# EAGLE design atmega_fusebit_doctor_V2e (EAGLE 5.07)
AUTHOR: PAWEL KISIELEWSKI (MANEKINEN); REV: 2.0
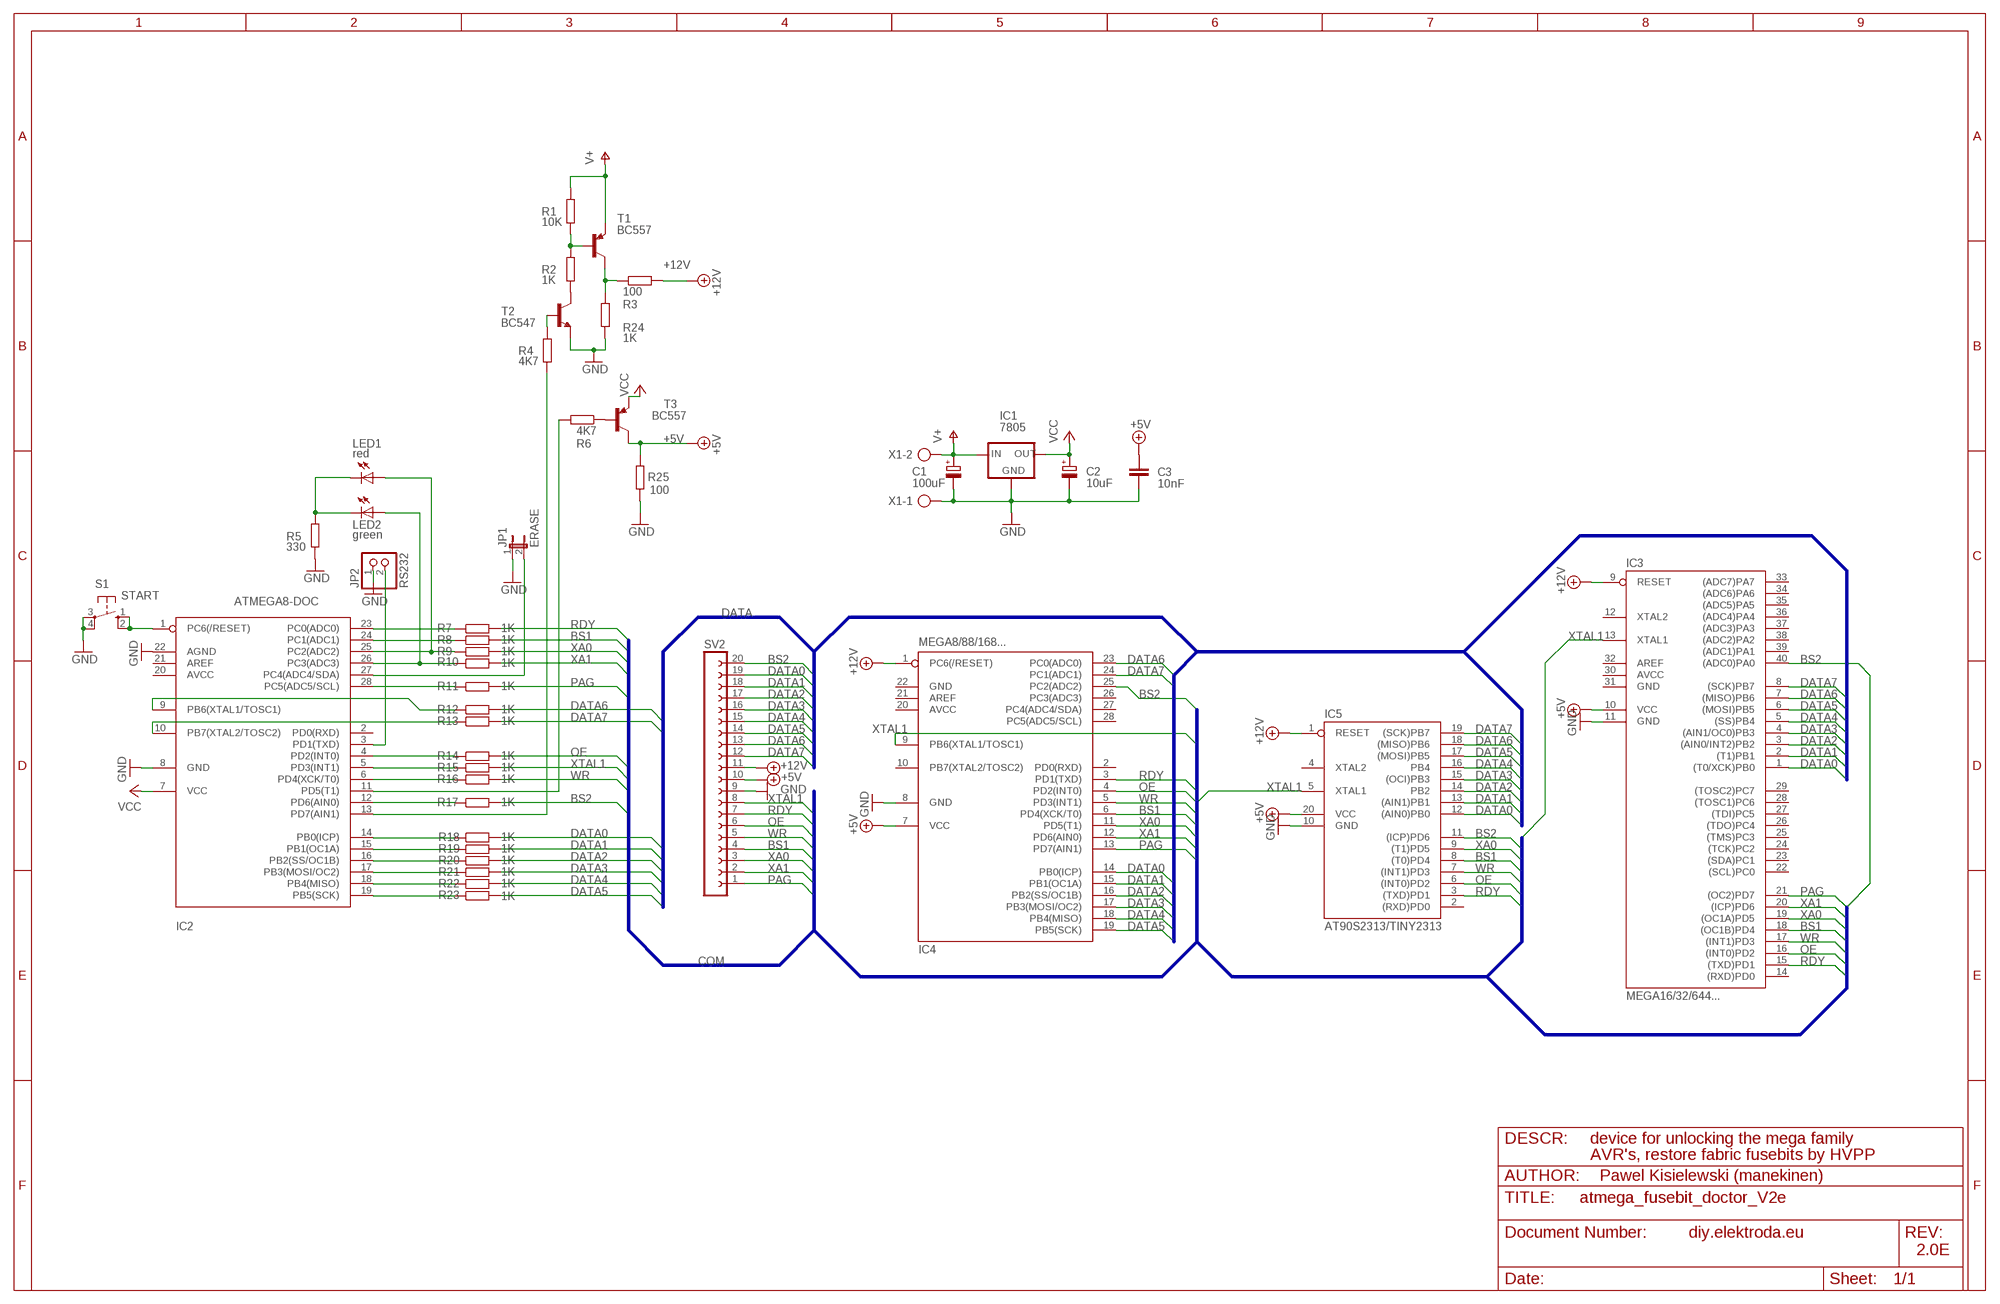
[diagram p0: schematic, sheet 1]

## Parts
C1  100uF  CPOL-EUE2.5-5  [E2,5-5]
C2  10uF  CPOL-EUE2.5-5  [E2,5-5]
C3  10nF  C-EU050-024X044  [C050-024X044]
IC1  7805  78XXL  [78XXL]
IC2  ATMEGA8-DOC  MEGA8-P  [DIL28-3]
IC3  MEGA16/32/644...  MEGA16-PZF1280  [240-1280-00-0602J]
IC4  MEGA8/88/168...  MEGA8-PZF-1277/3345  [228-1277-00-0602J]
IC5  AT90S2313/TINY2313  AT90S2313P  [DIL20]
JP1  ERASE  JP1E  [JP1]
JP2  RS232  PINHD-1X2  [1X02]
LED1  red  LED3MM  [LED3MM]
LED2  green  LED3MM  [LED3MM]
R1  10K  R-EU_0204/5  [0204/5]
R2  1K  R-EU_0204/5  [0204/5]
R3  100  R-EU_0204/5  [0204/5]
R4  4K7  R-EU_0204/5  [0204/5]
R5  330  R-EU_0204/5  [0204/5]
R6  4K7  R-EU_0204/5  [0204/5]
R7  1K  R-EU_0204/5  [0204/5]
R8  1K  R-EU_0204/5  [0204/5]
R9  1K  R-EU_0204/5  [0204/5]
R10  1K  R-EU_0204/5  [0204/5]
R11  1K  R-EU_0204/5  [0204/5]
R12  1K  R-EU_0204/5  [0204/5]
R13  1K  R-EU_0204/5  [0204/5]
R14  1K  R-EU_0204/5  [0204/5]
R15  1K  R-EU_0204/5  [0204/5]
R16  1K  R-EU_0204/5  [0204/5]
R17  1K  R-EU_0204/5  [0204/5]
R18  1K  R-EU_0204/5  [0204/5]
R19  1K  R-EU_0204/5  [0204/5]
R20  1K  R-EU_0204/5  [0204/5]
R21  1K  R-EU_0204/5  [0204/5]
R22  1K  R-EU_0204/5  [0204/5]
R23  1K  R-EU_0204/5  [0204/5]
R24  1K  R-EU_0204/5  [0204/5]
R25  100  R-EU_0204/5  [0204/5]
S1  START  10-XX  [B3F-10XX]
SV2  FE20-1  [FE20]
T1  BC557  BC557C-PNP-TO92-EBC  [TO92-EBC]
T2  BC547  BC547A-NPN-TO92-EBC  [TO92-EBC]
T3  BC557  BC557C-PNP-TO92-EBC  [TO92-EBC]
X1  AK500/2  [AK500/2]

## Nets
+5V: C3.1 IC3.10(VCC) IC4.7(VCC) IC5.20(VCC) R25.2 SV2.10 T3.C
+12V: IC3.9(RESET) IC4.1(PC6(/RESET)) IC5.1(RESET) R3.2 SV2.11
BS1: IC3.18((OC1B)PD4) IC4.6(PD4(XCK/T0)) IC5.8((T0)PD4) R8.2 SV2.4
BS2: IC3.40((ADC0)PA0) IC4.25(PC2(ADC2)) IC5.11((ICP)PD6) R17.2 SV2.20
DATA0: IC3.1((T0/XCK)PB0) IC4.14(PB0(ICP)) IC5.12((AIN0)PB0) R18.2 SV2.19
DATA1: IC3.2((T1)PB1) IC4.15(PB1(OC1A)) IC5.13((AIN1)PB1) R19.2 SV2.18
DATA2: IC3.3((AIN0/INT2)PB2) IC4.16(PB2(SS/OC1B)) IC5.14(PB2) R20.2 SV2.17
DATA3: IC3.4((AIN1/OC0)PB3) IC4.17(PB3(MOSI/OC2)) IC5.15((OCI)PB3) R21.2 SV2.16
DATA4: IC3.5((SS)PB4) IC4.18(PB4(MISO)) IC5.16(PB4) R22.2 SV2.15
DATA5: IC3.6((MOSI)PB5) IC4.19(PB5(SCK)) IC5.17((MOSI)PB5) R23.2 SV2.14
DATA6: IC3.7((MISO)PB6) IC4.23(PC0(ADC0)) IC5.18((MISO)PB6) R12.2 SV2.13
DATA7: IC3.8((SCK)PB7) IC4.24(PC1(ADC1)) IC5.19((SCK)PB7) R13.2 SV2.12
GND: C1.- C2.- C3.2 IC1.GND IC2.8(GND) IC2.22(AGND) IC3.11(GND) IC4.8(GND) IC5.10(GND) JP1.1 JP2.1 R5.1 R24.1 R25.1 S1.3(P) S1.4(P1) SV2.9 T2.E X1.1
N$1: R6.1 T3.B
N$2: IC2.14(PB0(ICP)) R18.1
N$3: IC2.3(PD1(TXD)) JP2.2
N$4: IC2.28(PC5(ADC5/SCL)) R11.1
N$5: IC2.6(PD4(XCK/T0)) R16.1
N$6: IC2.4(PD2(INT0)) R14.1
N$8: R2.2 T2.C
N$9: IC2.9(PB6(XTAL1/TOSC1)) R12.1
N$10: IC2.10(PB7(XTAL2/TOSC2)) R13.1
N$11: IC2.13(PD7(AIN1)) R4.2
N$12: IC2.11(PD5(T1)) R6.2
N$14: IC2.15(PB1(OC1A)) R19.1
N$16: IC2.16(PB2(SS/OC1B)) R20.1
N$19: IC2.5(PD3(INT1)) R15.1
N$21: IC2.23(PC0(ADC0)) R7.1
N$22: R3.1 R24.2 T1.C
N$24: IC2.17(PB3(MOSI/OC2)) R21.1
N$25: IC2.18(PB4(MISO)) R22.1
N$26: IC2.19(PB5(SCK)) R23.1
N$27: IC2.12(PD6(AIN0)) R17.1
N$29: R4.1 T2.B
N$31: IC2.27(PC4(ADC4/SDA)) JP1.2
N$32: LED1.K(C) LED2.K(C) R5.2
N$34: R1.2 R2.1 T1.B
N$42: IC2.24(PC1(ADC1)) R8.1
N$43: IC2.1(PC6(/RESET)) S1.1(S) S1.2(S1)
N$47: IC2.26(PC3(ADC3)) LED2.A R10.1
N$48: IC2.25(PC2(ADC2)) LED1.A R9.1
OE: IC3.16((INT0)PD2) IC4.4(PD2(INT0)) IC5.6((INT0)PD2) R14.2 SV2.6
PAG: IC3.21((OC2)PD7) IC4.13(PD7(AIN1)) R11.2 SV2.1
RDY: IC3.15((TXD)PD1) IC4.3(PD1(TXD)) IC5.3((TXD)PD1) R7.2 SV2.7
V+: C1.+ IC1.IN R1.1 T1.E X1.2
VCC: C2.+ IC1.OUT IC2.7(VCC) T3.E
WR: IC3.17((INT1)PD3) IC4.5(PD3(INT1)) IC5.7((INT1)PD3) R16.2 SV2.5
XA0: IC3.19((OC1A)PD5) IC4.11(PD5(T1)) IC5.9((T1)PD5) R9.2 SV2.3
XA1: IC3.20((ICP)PD6) IC4.12(PD6(AIN0)) R10.2 SV2.2
XTAL1: IC3.13(XTAL1) IC4.9(PB6(XTAL1/TOSC1)) IC5.5(XTAL1) R15.2 SV2.8
Unconnected: IC2.2(PD0(RXD)) IC2.20(AVCC) IC2.21(AREF) IC3.12(XTAL2) IC3.14((RXD)PD0) IC3.22((SCL)PC0) IC3.23((SDA)PC1) IC3.24((TCK)PC2) IC3.25((TMS)PC3) IC3.26((TDO)PC4) IC3.27((TDI)PC5) IC3.28((TOSC1)PC6) IC3.29((TOSC2)PC7) IC3.32(AREF) IC3.33((ADC7)PA7) IC3.34((ADC6)PA6) IC3.35((ADC5)PA5) IC3.36((ADC4)PA4) IC3.37((ADC3)PA3) IC3.38((ADC2)PA2) IC3.39((ADC1)PA1) IC4.2(PD0(RXD)) IC4.10(PB7(XTAL2/TOSC2)) IC4.21(AREF) IC4.26(PC3(ADC3)) IC4.27(PC4(ADC4/SDA)) IC4.28(PC5(ADC5/SCL)) IC5.2((RXD)PD0) IC5.4(XTAL2)

## Buses
DATA
COM

## Notes on the sheet
- DESCR: | device for unlocking the mega family
- AVR's, restore fabric fusebits by HVPP
- AUTHOR: | Pawel Kisielewski (manekinen)
- diy.elektroda.eu
- 2.0E

## Power pins joined to a net without a drawn wire
AVCC: IC3.30(AVCC) IC4.20(AVCC)
GND: IC3.31(GND) IC4.22(GND)

## Library data of the parts
C1 C2 = rcl:CPOL-EU: POLARIZED CAPACITOR, European symbol
C3 = rcl:C-EU: CAPACITOR, European symbol
IC1 = v-reg:78XXL: VOLTAGE REGULATOR
IC2 = atmel:MEGA8-P: MICROCONTROLLER 8 Kbytes FLASH 1 kbytes SRAM 512 bytes EEPROM USART 4-channel 10 bit ADC 2-channel 8 bit ADC Source: avr.lbr
IC3 = digital-toy:MEGA16-P: MICROCONTROLLER 16 Kbytes FLASH 1 kbytes SRAM 512 bytes EEPROM USART 8-channel 10 bit ADC Source: avr.lbr
IC4 = digital-toy:MEGA8-P: MICROCONTROLLER 8 Kbytes FLASH, 1 kbytes SRAM, 512 bytes EEPROM, USART, 4-channel 10 bit ADC, 2-channel 8 bit ADC Pin compatible with Atmega48, ATMega88, ATMega168 Source: avr.lbr
IC5 = atmel:AT90S2313: MICROCONTROLLER 2 Kbytes FLASH 128 bytes SRAM 128 bytes EEPROM UART
JP1 = jumper:JP1E: JUMPER
JP2 = pinhead:PINHD-1X2: PIN HEADER
LED1 LED2 = led:LED: LED OSRAM: - CHIPLED LG R971, LG N971, LY N971, LG Q971, LY Q971, LO R971, LY R971 LH N974, LH R974 LS Q976, LO Q976, LY Q976 LO Q996 - Hyper CHIPLED LW Q18S LB Q993, LB Q99A, LB R99A - SideLED LS A670, LO A670, LY A670, LG A670, LP A670 LB A673, LV A673, LT A673, LW A673 LH A674 LY A675 LS A676, LA A676, LO A676, LY A676, LW A676 LS A679, LY A679, LG A679 - Hyper Micro SIDELED® LS Y876, LA Y876, LO Y876, LY Y876 LT Y87S - SmartLED LW L88C, LW L88S LB L89C, LB L89S, LG L890 LS L89K, LO L89K, LY L89K LS L896, LA L896, LO L896, LY L896 - TOPLED LS T670, LO T670, LY T670, LG T670, LP T670 LSG T670, LSP T670, LSY T670, LOP T670, LYG T670 LG T671, LOG T671, LSG T671 LB T673, LV T673, LT T673, LW T673 LH T674 LS T676, LA T676, LO T676, LY T676, LB T676, LH T676, LSB T676, LW T676 LB T67C, LV T67C, LT T67C, LS T67K, LO T67K, LY T67K, LW E67C LS E67B, LA E67B, LO E67B, LY E67B, LB E67C, LV E67C, LT E67C LW T67C LS T679, LY T679, LG T679 LS T770, LO T770, LY T770, LG T770, LP T770 LB T773, LV T773, LT T773, LW T773 LH T774 LS E675, LA E675, LY E675, LS T675 LS T776, LA T776, LO T776, LY T776, LB T776 LHGB T686 LT T68C, LB T68C - Hyper Mini TOPLED® LB M676 - Mini TOPLED Santana® LG M470 LS M47K, LO M47K, LY M47K Source: http://www.osram.convergy.de - LUMILED® LXK2-PW12-R00, LXK2-PW12-S00, LXK2-PW14-U00, LXK2-PW14-V00 LXK2-PM12-R00, LXK2-PM12-S00, LXK2-PM14-U00 LXK2-PE12-Q00, LXK2-PE12-R00, LXK2-PE12-S00, LXK2-PE14-T00, LXK2-PE14-U00 LXK2-PB12-K00, LXK2-PB12-L00, LXK2-PB12-M00, LXK2-PB14-N00, LXK2-PB14-P00, LXK2-PB14-Q00 LXK2-PR12-L00, LXK2-PR12-M00, LXK2-PR14-Q00, LXK2-PR14-R00 LXK2-PD12-Q00, LXK2-PD12-R00, LXK2-PD12-S00 LXK2-PH12-R00, LXK2-PH12-S00 LXK2-PL12-P00, LXK2-PL12-Q00, LXK2-PL12-R00 Source: www.luxeon.com
R1-R25 = rcl:R-EU_: RESISTOR, European symbol
S1 = switch-omron:10-XX: OMRON SWITCH
SV2 = con-lsta:FE20-1: FEMALE HEADER
T1 T3 = transistor:*-PNP-: PNP Transistror
T2 = transistor:*-NPN-: NPN Transistror
X1 = con-ptr500:AK500/2: CONNECTOR

## Board
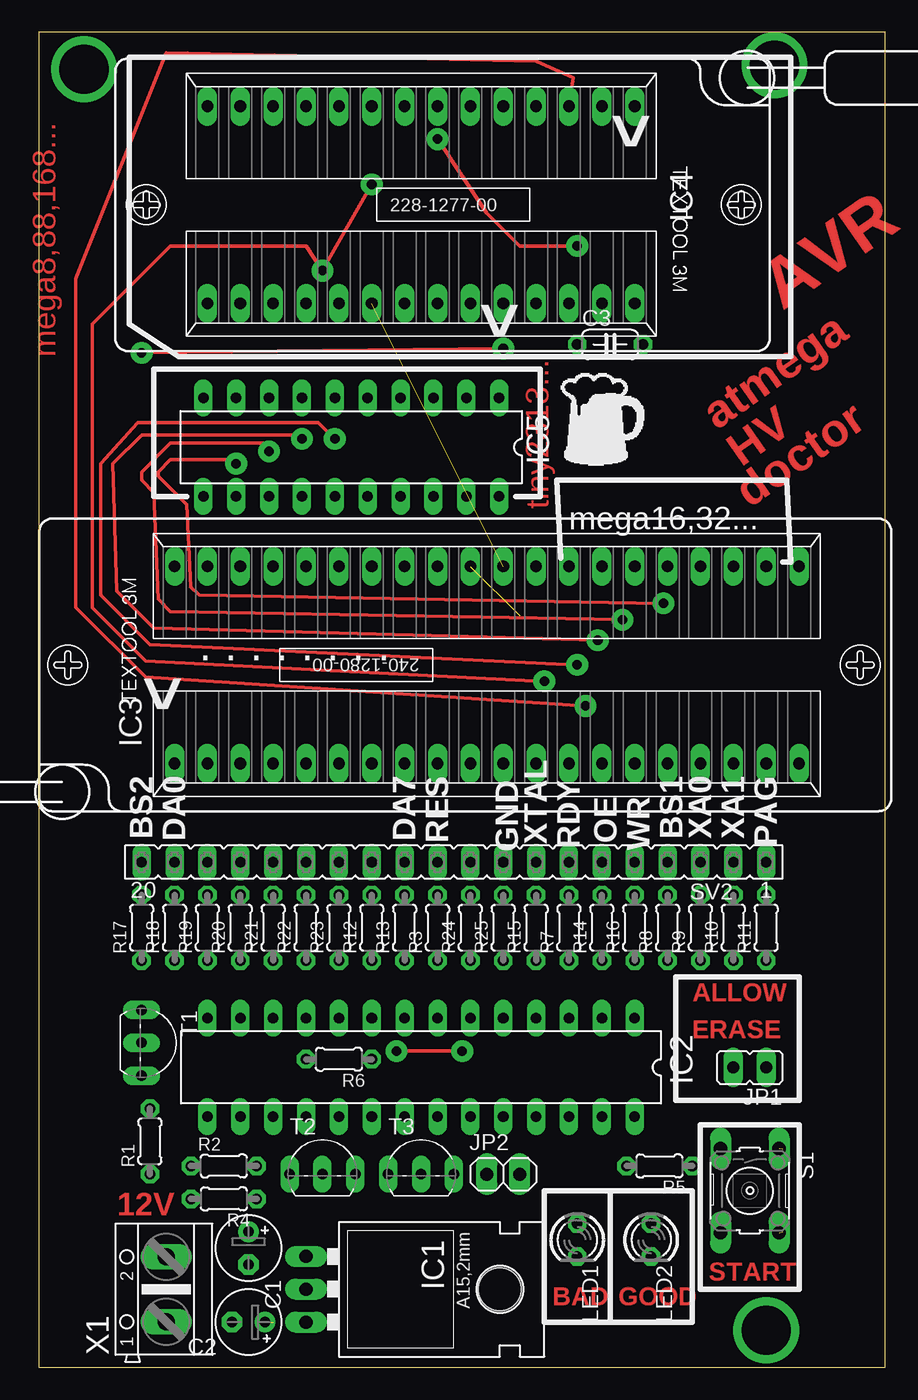
[diagram p1: board, top side]
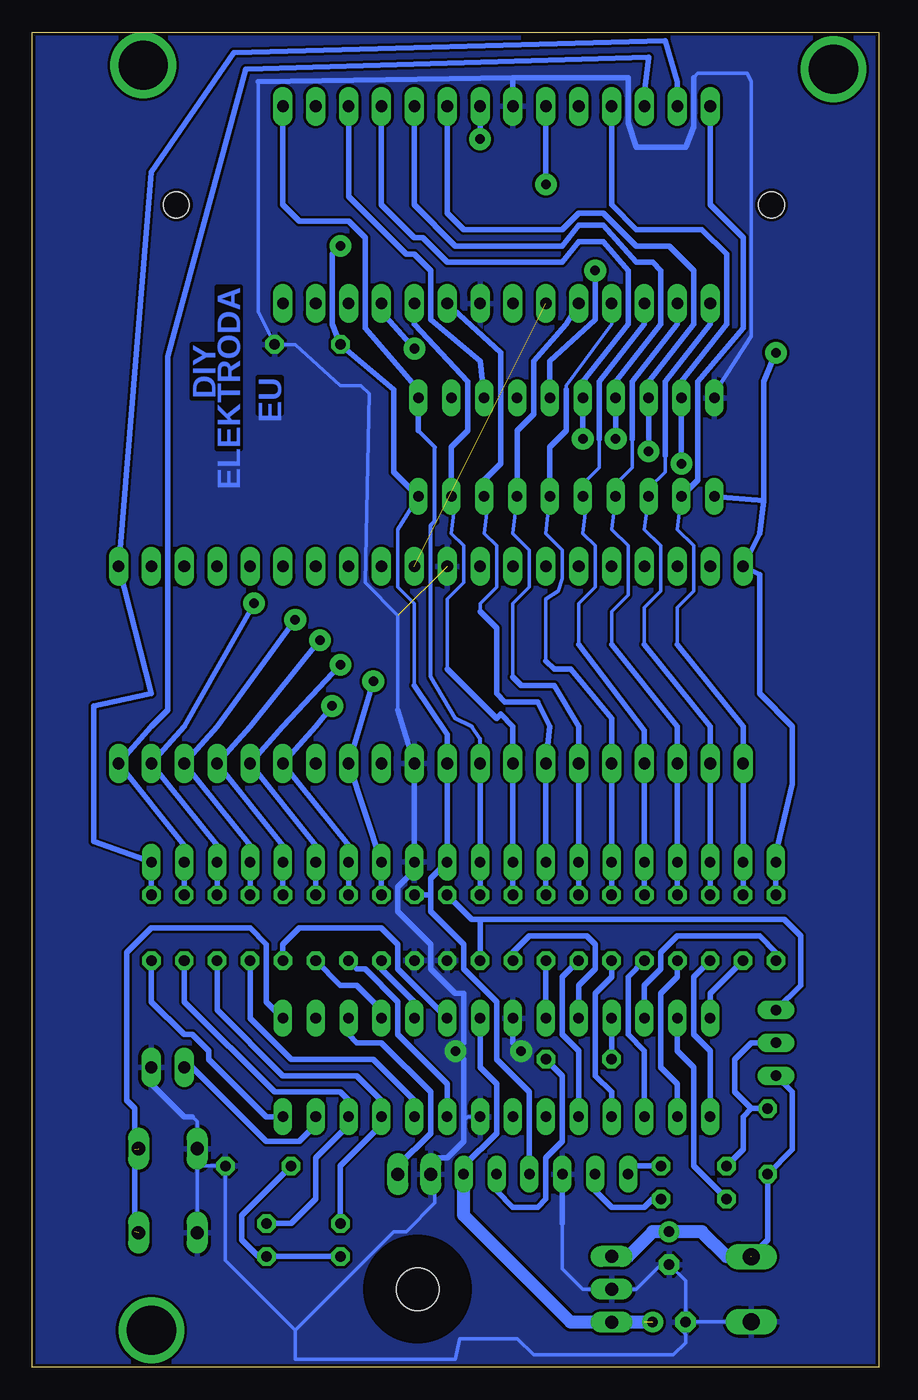
[diagram p2: board, bottom side, seen from below]

Size 65.39 x 103.18 mm. Coordinates in mm from the lower left corner, seen from the top.
Outline: 0,103.18 0,0 65.4,0 65.4,103.18 0,103.18
Copper layers (1*16): Top 0.035mm / dielectric 1.5mm / Bottom 0.035mm
Design rules "SparkFun": minimum track width 8mil, minimum drill 20mil, track to track 8mil, track to pad 8mil, pad to pad 8mil, via to via 8mil, smd to smd 8mil, copper to edge 10mil, drill to drill 8mil, minimum pad ring 12mil, minimum via ring 10mil, stop-mask expansion 4mil, vias tented up to drill 25mil, thermal gap 10mil

### Footprints (pad centres in the part's own frame; a part is rotated, then mirrored left to right if it is on the bottom)
E2,5-5 = drill 0.813 pad 1.6 round: + -1.27,0 | drill 0.813 pad 1.6 octagon: - 1.27,0
C050-024X044 = drill 0.813 octagon: 1 -2.54,0; 2 2.54,0
78XXL = drill 1.016 long: GND 0,-3.81; IN -2.54,-3.81; OUT 2.54,-3.81 | hole 3.302: 0,11.176
DIL28-3 = drill 0.813 long: 1 -16.51,-3.81; 2 -13.97,-3.81; 3 -11.43,-3.81; 4 -8.89,-3.81; 5 -6.35,-3.81; 6 -3.81,-3.81; 7 -1.27,-3.81; 8 1.27,-3.81; 9 3.81,-3.81; 10 6.35,-3.81; 11 8.89,-3.81; 12 11.43,-3.81; 13 13.97,-3.81; 14 16.51,-3.81; 15 16.51,3.81; 16 13.97,3.81; 17 11.43,3.81; 18 8.89,3.81; 19 6.35,3.81; 20 3.81,3.81; 21 1.27,3.81; 22 -1.27,3.81; 23 -3.81,3.81; 24 -6.35,3.81; 25 -8.89,3.81; 26 -11.43,3.81; 27 -13.97,3.81; 28 -16.51,3.81
240-1280-00-0602J = drill 0.9 long: 1 -24.13,-7.62; 2 -21.59,-7.62; 3 -19.05,-7.62; 4 -16.51,-7.62; 5 -13.97,-7.62; 6 -11.43,-7.62; 7 -8.89,-7.62; 8 -6.35,-7.62; 9 -3.81,-7.62; 10 -1.27,-7.62; 11 1.27,-7.62; 12 3.81,-7.62; 13 6.35,-7.62; 14 8.89,-7.62; 15 11.43,-7.62; 16 13.97,-7.62; 17 16.51,-7.62; 18 19.05,-7.62; 19 21.59,-7.62; 20 24.13,-7.62; 21 24.13,7.62; 22 21.59,7.62; 23 19.05,7.62; 24 16.51,7.62; 25 13.97,7.62; 26 11.43,7.62; 27 8.89,7.62; 28 6.35,7.62; 29 3.81,7.62; 30 1.27,7.62; 31 -1.27,7.62; 32 -3.81,7.62; 33 -6.35,7.62; 34 -8.89,7.62; 35 -11.43,7.62; 36 -13.97,7.62; 37 -16.51,7.62; 38 -19.05,7.62; 39 -21.59,7.62; 40 -24.13,7.62
228-1277-00-0602J = drill 0.9 long: 1 -16.51,-7.62; 2 -13.97,-7.62; 3 -11.43,-7.62; 4 -8.89,-7.62; 5 -6.35,-7.62; 6 -3.81,-7.62; 7 -1.27,-7.62; 8 1.27,-7.62; 9 3.81,-7.62; 10 6.35,-7.62; 11 8.89,-7.62; 12 11.43,-7.62; 13 13.97,-7.62; 14 16.51,-7.62; 15 16.51,7.62; 16 13.97,7.62; 17 11.43,7.62; 18 8.89,7.62; 19 6.35,7.62; 20 3.81,7.62; 21 1.27,7.62; 22 -1.27,7.62; 23 -3.81,7.62; 24 -6.35,7.62; 25 -8.89,7.62; 26 -11.43,7.62; 27 -13.97,7.62; 28 -16.51,7.62 | hole 2: 21.24,0; -24.74,0
DIL20 = drill 0.813 long: 1 -11.43,-3.81; 2 -8.89,-3.81; 3 -6.35,-3.81; 4 -3.81,-3.81; 5 -1.27,-3.81; 6 1.27,-3.81; 7 3.81,-3.81; 8 6.35,-3.81; 9 8.89,-3.81; 10 11.43,-3.81; 11 11.43,3.81; 12 8.89,3.81; 13 6.35,3.81; 14 3.81,3.81; 15 1.27,3.81; 16 -1.27,3.81; 17 -3.81,3.81; 18 -6.35,3.81; 19 -8.89,3.81; 20 -11.43,3.81
JP1 = drill 0.914 long: 1 0,-1.27; 2 0,1.27
1X02 = drill 1.016 long: 1 -1.27,0; 2 1.27,0
LED3MM = drill 0.813 octagon: A -1.27,0; K 1.27,0
0204/5 = drill 0.813 octagon: 1 -2.54,0; 2 2.54,0
B3F-10XX = drill 1.016 long: 1 -3.251,2.261; 2 3.251,2.261; 3 -3.251,-2.261; 4 3.251,-2.261
FE20 = drill 0.813 long: 1 -24.13,0; 2 -21.59,0; 3 -19.05,0; 4 -16.51,0; 5 -13.97,0; 6 -11.43,0; 7 -8.89,0; 8 -6.35,0; 9 -3.81,0; 10 -1.27,0; 11 1.27,0; 12 3.81,0; 13 6.35,0; 14 8.89,0; 15 11.43,0; 16 13.97,0; 17 16.51,0; 18 19.05,0; 19 21.59,0; 20 24.13,0
TO92-EBC = drill 0.813 long: B 0,-1.27; C -2.54,-1.27; E 2.54,-1.27
AK500/2 = drill 1.321 long: 1 -2.515,0; 2 2.515,0

### Placement (x,y rotation side)
C1  16.19,9.2 270 top
C2  16.19,3.48 180 top
C3  44.13,79.05 0 top
IC1  24.45,6.02 270 top
IC2  29.53,23.17 180 top
IC3  34.61,54.28 0 top
IC4  29.53,89.84 180 top
IC5  24.13,71.11 180 top
JP1  54.93,23.17 90 top
JP2  35.88,14.91 0 top
LED1  41.59,9.83 270 top
LED2  47.31,9.83 270 top
R1  8.57,17.45 90 top
R2  14.29,15.55 0 top
R3  30.8,33.96 90 top
R4  14.29,13.01 180 top
R5  47.94,15.55 180 top
R6  23.18,23.8 180 top
R7  40.96,33.96 90 top
R8  48.58,33.96 90 top
R9  51.12,33.96 90 top
R10  53.66,33.96 90 top
R11  56.2,33.96 90 top
R12  25.72,33.96 90 top
R13  28.26,33.96 90 top
R14  43.5,33.96 90 top
R15  38.42,33.96 90 top
R16  46.04,33.96 90 top
R17  7.94,33.96 90 top
R18  10.48,33.96 90 top
R19  13.02,33.96 90 top
R20  15.56,33.96 90 top
R21  18.1,33.96 90 top
R22  20.64,33.96 90 top
R23  23.18,33.96 90 top
R24  33.34,33.96 90 top
R25  35.88,33.96 90 top
S1  54.93,13.64 270 top
SV2  32.07,39.04 180 top
T1  9.21,25.07 270 top
T2  21.91,16.18 0 top
T3  29.53,16.18 0 top
X1  9.84,6.02 90 top

### Tracks (layer width: path | path; a pad name or v marks a point on that pad's centre or on a via)
+5V  (via drill 0.74 pad 1.68)
  Top 0.254: v41.59,86.67 37.15,86.67 34.61,89.21 v30.8,94.92
  Bottom 0.254: 35.88,52.69 35.88,59.04 37.15,60.32 37.15,64.76 IC5.20
  Bottom 0.406: 35.88,52.69 33.34,48.89 IC3.10 SV2.10 34.61,37.77 34.61,36.5 | v30.8,94.92 IC4.7 | IC5.20 37.47,69.2 37.47,75.56 C3.1 42.23,80.64 42.23,86.03 v41.59,86.67 | 34.61,36.5 34.61,35.23 32.07,32.69 32.07,30.79 29.53,28.25 29.53,23.8 26.99,21.26 T3.C | 34.61,36.5 R25.2
+12V
  Bottom 0.305: 35.56,72.38 34.29,71.11 34.29,65.4 34.61,65.08 34.61,53.33 32.7,50.15 31.43,49.52 30.8,48.57 IC3.9
  Bottom 0.406: IC4.1 46.04,89.84 44.77,88.57 40.96,88.57 39.69,87.3 39.69,80.32 35.56,75.56 IC5.1 35.56,72.38 | SV2.11 IC3.9 | SV2.11 30.8,38.41 | R3.2 SV2.11
AVCC  (1 unrouted)
BS1  (via drill 0.74 pad 1.68)
  Top 0.254: v45.09,57.77 10.16,58.41 9.21,59.36 8.89,67.62 7.94,68.57 7.94,69.2 10.16,71.43 17.46,71.43 v17.78,70.79
  Bottom 0.406: IC4.6 33.34,89.21 32.07,87.94 24.45,87.94 23.18,89.21 21.27,89.21 18.73,86.67 16.19,86.67 14.29,84.76 14.29,80.64 17.78,76.19 IC5.8 v17.78,70.79 | v45.09,57.77 51.12,49.52 IC3.18 48.58,40.31 SV2.4 R8.2
BS2  (via drill 0.74 pad 1.68)
  Top 0.254: v7.94,78.41 v35.88,78.73
  Bottom 0.406: v7.94,78.41 8.89,76.19 8.89,66.98 | IC4.25 38.42,81.59 v35.88,78.73 | 8.89,66.98 9.21,64.44 IC3.40 9.21,61.27 9.21,52.06 6.67,49.52 6.67,45.08 7.94,39.68 SV2.20 R17.2 | 8.89,66.98 IC5.11
DATA0
  Bottom 0.254: 15.56,55.87 15.56,58.73 14.29,60 14.29,63.49 15.56,64.76 IC5.12
  Bottom 0.406: IC4.14 13.02,89.84 10.48,87.3 10.48,80.32 13.97,76.19 13.97,68.57 IC5.12 | 15.56,55.87 10.48,49.52 IC3.1 SV2.19 R18.2
DATA1
  Bottom 0.254: 18.1,55.87 18.1,58.73 16.83,60 16.83,63.49 18.1,64.76 IC5.13 17.78,67.94 16.51,69.2 16.51,70.48
  Bottom 0.406: IC4.15 13.02,80.64 16.51,76.19 16.51,70.48 | 18.1,55.87 13.02,49.52 IC3.2 SV2.18 R19.2
DATA2
  Bottom 0.254: 20.64,55.87 20.64,58.41 19.37,59.68 19.37,63.49 20.64,64.76 IC5.14 20.32,68.25 19.05,69.52 19.05,71.75
  Bottom 0.406: IC4.16 15.56,80.64 19.05,76.19 19.05,71.75 | 20.64,55.87 15.56,49.52 IC3.3 SV2.17 R20.2
DATA3
  Bottom 0.254: 23.18,55.87 23.18,59.04 21.91,60.32 21.91,63.49 22.86,64.44 22.54,66.98 IC5.15 22.86,68.25 21.59,69.52 21.59,71.75
  Bottom 0.406: IC4.17 18.1,80.64 21.59,76.19 21.59,71.75 | 23.18,55.87 18.1,49.2 IC3.4 SV2.16 R21.2
DATA4
  Bottom 0.254: 25.72,54.6 25.72,59.36 24.76,60 24.45,60.95 24.45,63.17 25.72,64.44 IC5.16 | 24.13,75.56 24.13,75.87 20.64,80.64 IC4.18
  Bottom 0.406: 24.13,75.56 24.13,72.38 25.4,71.11 IC5.16 | 25.72,54.6 25.08,53.97 23.81,53.97 20.64,50.15 IC3.5 SV2.15 R22.2
DATA5
  Bottom 0.254: 28.26,53.33 28.26,59.04 26.99,60.32 26.99,63.17 28.26,64.44 IC5.17
  Bottom 0.406: IC4.19 24.13,80.64 26.67,77.78 26.67,73.65 27.94,72.38 IC5.17 | 28.26,53.33 27.62,52.69 25.08,52.69 23.18,49.52 IC3.6 SV2.14 R23.2
DATA6
  Bottom 0.254: 30.8,58.41 30.8,59.04 29.53,60.32 29.53,63.49 30.48,64.44 30.16,66.98 IC5.18
  Bottom 0.406: IC4.23 29.21,78.41 29.21,69.84 30.48,68.57 IC5.18 | 30.8,58.41 29.53,57.14 29.53,52.06 28.89,51.43 26.35,51.43 25.4,49.52 IC3.7 SV2.13 R12.2
DATA7
  Bottom 0.254: 33.34,53.97 33.34,59.36 32.07,60.63 32.07,63.49 33.02,64.44 32.7,66.98 IC5.19
  Bottom 0.406: IC4.24 35.88,80.64 31.75,76.19 31.75,72.38 33.02,71.11 IC5.19 | 33.34,53.97 29.53,50.15 29.21,50.47 28.26,49.52 IC3.8 SV2.12 R13.2
GND  (via drill 0.74 pad 1.68)  (1 unrouted)
  Top 0.254: v32.7,24.44 v27.62,24.44
  Bottom 0.254: 37.15,50.79 37.15,58.09 39.69,60.63 39.37,75.24 40.01,75.87 41.59,75.87 45.09,79.05 C3.2 47.94,81.59 47.94,99.37 | X1.1 14.92,3.51 C2.- | C2.- 14.92,6.66 C1.- 16.83,7.93 18.73,6.02 IC1.GND 22.86,6.02 24.45,7.61 24.45,11.1 | 52.67,15.55 S1.4 | 52.67,15.55 S1.3 52.67,19 53.02,19.36 | 52.67,15.55 R5.1 50.48,8.25 45.09,2.85 | JP2.1 34.29,14.6 34.29,12.69 36.51,10.47 37.47,10.47 45.09,2.85 | IC2.22 31.75,19.36 32.07,19.04 | C2.- 15.24,3.16 15.24,2.85 14.92,2.53 14.92,1.9 15.87,0.94 26.67,0.94 27.94,2.21 32.39,2.21 32.7,0.63 45.09,0.63 45.09,2.85 | IC5.10 12.7,75.24 9.84,79.68 9.84,99.37 10.16,100 13.97,100 14.29,99.69
  Bottom 0.406: 14.29,99.69 14.29,95.87 14.92,94.29 18.73,94.29 19.37,96.19 19.37,99.69 28.26,99.69 | 37.15,50.79 IC3.11 SV2.9 35.88,38.41 37.15,37.14 37.15,35.23 34.61,32.69 34.61,30.79 32.7,28.88 32.07,28.88 32.07,25.07 v32.7,24.44 32.07,23.8 32.07,19.04 32.07,17.45 33.34,16.18 34.61,16.18 JP2.1 | v27.62,24.44 28.26,25.07 IC2.8 | 28.26,99.69 IC4.8 | 47.94,99.37 28.26,99.69 | 24.45,11.1 T2.E | JP1.1 56.2,21.9 53.66,19.36 53.02,19.36
  pour Bottom: 75.25,107.31 -5.72,105.72 -5.72,-20.01 73.66,-21.28
N$1
  Bottom 0.406: R6.1 24.45,22.53 24.45,17.45 25.72,16.18 25.72,13.01 26.35,12.37 28.26,12.37 29.53,13.64 T3.B
N$2
  Bottom 0.406: R18.1 13.02,28.88 IC2.14
N$3
  Bottom 0.406: IC2.3 40.96,25.71 40.32,25.07 38.42,25.07 34.61,21.26 34.61,18.09 37.15,15.55 JP2.2
N$4
  Bottom 0.406: R11.1 56.2,28.25 53.66,25.71 53.02,25.71 51.75,24.44 51.75,23.8 47.31,19.36 IC2.28
N$5
  Bottom 0.406: R16.1 46.04,32.69 44.77,33.96 38.42,33.96 37.15,32.69 37.15,30.79 IC2.6
N$6
  Bottom 0.406: R14.1 41.59,29.52 40.32,29.52 38.42,27.61 IC2.4
N$8
  Bottom 0.406: R2.2 18.73,15.55 T2.C
N$9
  Bottom 0.406: IC2.9 R12.1
N$10
  Bottom 0.406: IC2.10 23.18,29.52 21.91,30.79 21.91,32.69 22.54,33.33 26.99,33.33 28.26,32.06 R13.1
N$11
  Bottom 0.406: R4.2 14.29,15.55 14.29,23.17 15.56,24.44 IC2.13
N$12
  Bottom 0.406: R6.2 IC2.11
N$13  (via drill 3.81 pad 5.08)
  other vias: 56.2,2.85
N$14
  Bottom 0.406: R19.1 14.29,30.15 14.29,25.71 13.02,24.44 IC2.15
N$15  (via drill 3.81 pad 5.08)
  other vias: 56.83,100.64
N$16
  Bottom 0.406: R20.1 15.56,30.15 16.83,28.88 16.83,23.17 15.56,21.9 IC2.16
N$17  (via drill 3.81 pad 5.08)
  other vias: 3.49,100.32
N$19
  Bottom 0.406: R15.1 38.42,30.79 35.88,28.25 IC2.5
N$21
  Bottom 0.406: R7.1 40.32,30.79 39.69,30.79 37.15,28.25 37.15,25.71 33.34,21.9 IC2.23
N$22
  Bottom 0.406: 30.8,34.6 R3.1 | 30.8,34.6 7.3,34.6 6.03,33.33 6.03,29.52 T1.C | 30.8,34.6 31.43,34.6 R24.2
N$24
  Bottom 0.406: R21.1 19.37,30.15 19.37,25.71 18.1,24.44 IC2.17
N$25
  Bottom 0.406: R22.1 20.64,30.15 21.91,28.88 21.91,22.53 20.64,21.26 IC2.18
N$26
  Bottom 0.406: R23.1 24.45,30.15 24.45,25.71 23.18,24.44 IC2.19
N$27
  Bottom 0.406: R17.1 7.94,32.06 9.21,33.33 15.56,33.33 16.83,32.06 16.83,30.79 18.1,29.52 IC2.12
N$29
  Bottom 0.406: R4.1 17.46,13.01 18.1,12.37 20.64,12.37 21.91,13.64 T2.B
N$31
  Bottom 0.406: IC2.27 43.5,18.72 44.77,17.45 47.31,17.45 53.02,23.17 JP1.2
N$32
  Bottom 0.406: LED2.K LED1.K LED2.K | LED2.K 47.94,8.56 49.21,9.83 49.21,11.74 R5.2
N$34
  Bottom 0.406: T1.B 9.84,25.07 11.11,23.8 11.11,21.26 9.84,19.99 | R2.1 10.48,16.82 10.48,19.36 9.84,19.99 | 9.84,19.99 R1.2
N$42
  Bottom 0.406: R8.1 48.58,26.98 45.4,23.8 39.05,23.8 35.88,20.63 IC2.24
N$43  (2 unrouted)
  Bottom 0.406: IC2.1 47.31,28.25 47.31,32.69 48.58,33.96 56.2,33.96 58.1,32.06 58.1,20.63 57.47,19.99 57.47,16.82 57.47,10.47
N$47
  Bottom 0.406: LED2.A 45.4,11.1 43.5,13.01 43.5,16.18 40.96,18.72 IC2.26 40.96,20.63 41.59,21.26 46.67,21.26 53.66,28.25 R10.1
N$48
  Bottom 0.406: R9.1 51.12,27.61 46.04,22.53 40.32,22.53 38.42,20.63 IC2.25 38.42,18.72 41.59,15.55 LED1.A
OE  (via drill 0.74 pad 1.68)
  Top 0.254: v41.59,54.28 8.57,55.87 4.76,59.68 4.76,69.84 7.62,73.01 21.59,73.01 v22.86,71.75
  Bottom 0.406: IC4.4 38.42,89.84 35.88,87.3 35.24,87.3 33.34,85.4 24.45,85.4 23.18,86.98 21.27,86.98 19.37,84.76 19.37,80.64 22.86,76.19 IC5.6 v22.86,71.75 | v41.59,54.28 46.04,49.52 IC3.16 43.5,40.31 SV2.6 R14.2
PAG
  Bottom 0.406: IC4.13 15.56,99.37 16.51,102.54 49.85,101.59 56.2,92.38 IC3.21 56.2,52.06 60.64,51.11 60.64,40.63 SV2.1 R11.2
RDY  (via drill 0.74 pad 1.68)
  Top 0.254: v42.23,51.11 8.25,53.33 2.86,58.73 2.86,84.13 9.84,101.59 38.42,100.95 41.27,99.69 IC4.3
  Bottom 0.406: IC4.3 40.96,90.48 36.51,86.03 35.88,86.03 34.61,84.76 34.61,80.95 30.8,77.78 IC5.3 | v42.23,51.11 43.5,49.52 IC3.15 40.96,40.31 SV2.7 R7.2
V+  (1 unrouted)
  Bottom 0.406: T1.E 6.67,21.26 6.67,16.82 R1.1 8.57,9.83 9.84,8.56
  Bottom 1.016: 9.84,8.56 11.75,8.56 13.65,10.47 C1.+ 17.46,10.47 19.37,8.56 IC1.IN
VCC  (1 unrouted)
  Bottom 0.406: IC2.7 30.8,23.17 29.53,21.9 29.53,18.09 32.07,15.55 T3.E
  Bottom 1.016: T3.E 32.07,11.74 23.81,3.48 IC1.OUT 18.1,3.48
WR  (via drill 0.74 pad 1.68)
  Top 0.254: v43.18,56.19 8.89,57.14 6.03,60 5.72,69.84 7.94,72.06 20,72.06 v20.32,71.75
  Bottom 0.406: v20.32,71.75 IC5.7 20.32,76.19 16.83,80.64 16.83,84.76 17.46,85.4 18.73,85.4 21.27,88.25 23.18,88.25 24.45,86.67 32.7,86.67 35.88,89.84 IC4.5 | v43.18,56.19 48.58,49.52 IC3.17 46.04,40.31 SV2.5 R16.2
XA0  (via drill 0.74 pad 1.68)
  Top 0.254: v48.26,59.04 12.38,59.68 11.75,60.32 11.43,66.66 9.21,68.89 9.21,69.2 10.16,70.16 14.92,70.16 v15.24,69.84
  Bottom 0.406: IC4.11 20.64,89.84 18.73,87.94 13.65,87.94 11.75,86.03 11.75,80.64 15.24,76.19 IC5.9 v15.24,69.84 | v48.26,59.04 53.66,49.52 IC3.19 51.12,40.31 SV2.3 R9.2
XA1
  Bottom 0.406: IC4.12 18.1,98.42 17.78,101.27 48.9,100.32 54.93,78.09 54.93,50.79 56.2,49.52 IC3.20 53.66,40.31 SV2.2 R10.2
XTAL1  (via drill 0.74 pad 1.68)
  Top 0.254: v25.72,91.43 v21.91,84.76 20.64,86.67 10.16,86.67 4.13,80.64 4.13,58.73 8.25,54.6 v39.05,53.01
  Bottom 0.406: v25.72,91.43 IC4.9 | v21.91,84.76 21.91,80.95 25.4,77.78 IC5.5 | v39.05,53.01 IC3.13 SV2.8 R15.2

### Text on the board
Top: AVR | mega8,88,168... | atmega | HV | tiny2313... | doctor | ALLOW | ERASE | 12V | START | BAD | GOOD
Bottom: ELEKTRODA | DIY | EU
tPlace: ^ | ^ | mega16,32... | ^ | . . . . . . . . | XTAL | BS2 | DA0 | DA7 | RES | GND | RDY | BS1 | XA0 | XA1 | PAG | OE | WR